# EAGLE schematic modul_zasilacza (EAGLE 7.7.0)
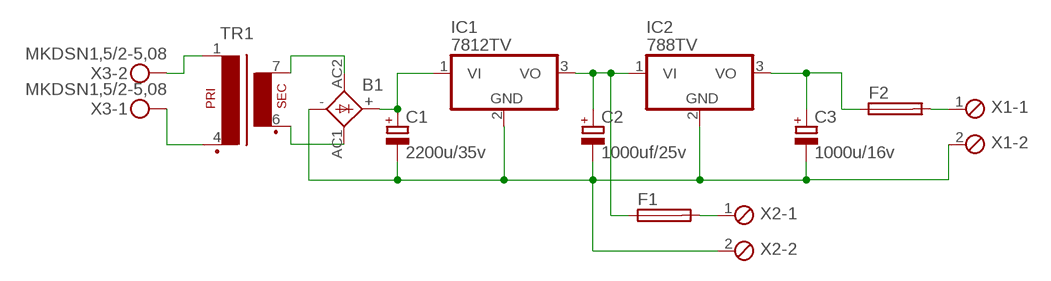
[diagram p0: schematic, sheet 1]

## Parts
B1  KBL  [KBL]
C1  2200u/35v  CPOL-EUE3.5-8  [E3,5-8]
C2  1000uf/25v  CPOL-EUE3.5-8  [E3,5-8]
C3  1000u/16v  CPOL-EUE3.5-8  [E3,5-8]
F1  GSH15  [GSH15]
F2  GSH15  [GSH15]
IC1  7812TV  [TO220V]
IC2  788TV  [TO220V]
TR1  EE20-1  [EE20-1]
X1  MPT2  [2POL254]
X2  MPT2  [2POL254]
X3  MKDSN1,5/2-5,08  [MKDSN1,5/2-5,08]

## Nets
N$1: B1.+ C1.+ IC1.1(VI)
N$2: B1.AC1(AC2) TR1.6(S3)
N$3: B1.AC2(AC1) TR1.7(S4)
N$4: B1.- C1.- C2.- C3.- IC1.2(GND) IC2.2(GND) X1.2 X2.2
N$5: C2.+ F1.1 IC1.3(VO) IC2.1(VI)
N$6: F1.2 X2.1
N$7: C3.+ F2.1 IC2.3(VO)
N$8: F2.2 X1.1
N$10: TR1.1 X3.2
N$11: TR1.4(P2) X3.1

## Library data of the parts
B1 = rectifier:KBL: DIOTEC RECTIFIER
C1-C3 = rcl:CPOL-EU: POLARIZED CAPACITOR, European symbol
F1 F2 = fuse:GSH15: FUSE HOLDER grid 15mm, 19649 Wickmann; MPN: 64900001039; OC_FARNELL: 1271673; OC_NEWARK: 02P0318
IC1 IC2 = linear:78*: Positive VOLTAGE REGULATOR Source: http://cache.national.com/ds/LM/LM78L05.pdf http://www.fairchildsemi.com/ds/LM/LM7805.pdf
TR1 = trafo:EE20-1: TRANSFORMER 1 primary winding, 1 secondary winding ERA
X1 X2 = con-phoenix-254:MPT2: PHOENIX CONNECTOR; OC_FARNELL: unknown; OC_NEWARK: unknown
X3 = con-phoenix-508:MKDSN1,5/2-5,08: MKDSN 1,5/ 2-5,08 Printklemme Nennstrom: 13,5 A Nennspannung: 250 V Rastermaß: 5,08 mm Polzahl: 2 Anschlussart: Schraubanschluss Montage: Löten Anschlussrichtung Leiter/Platine: 0 ° Artikelnummer: 1729128 Source: http://eshop.phoenixcontact.com .. 1729128.pdf